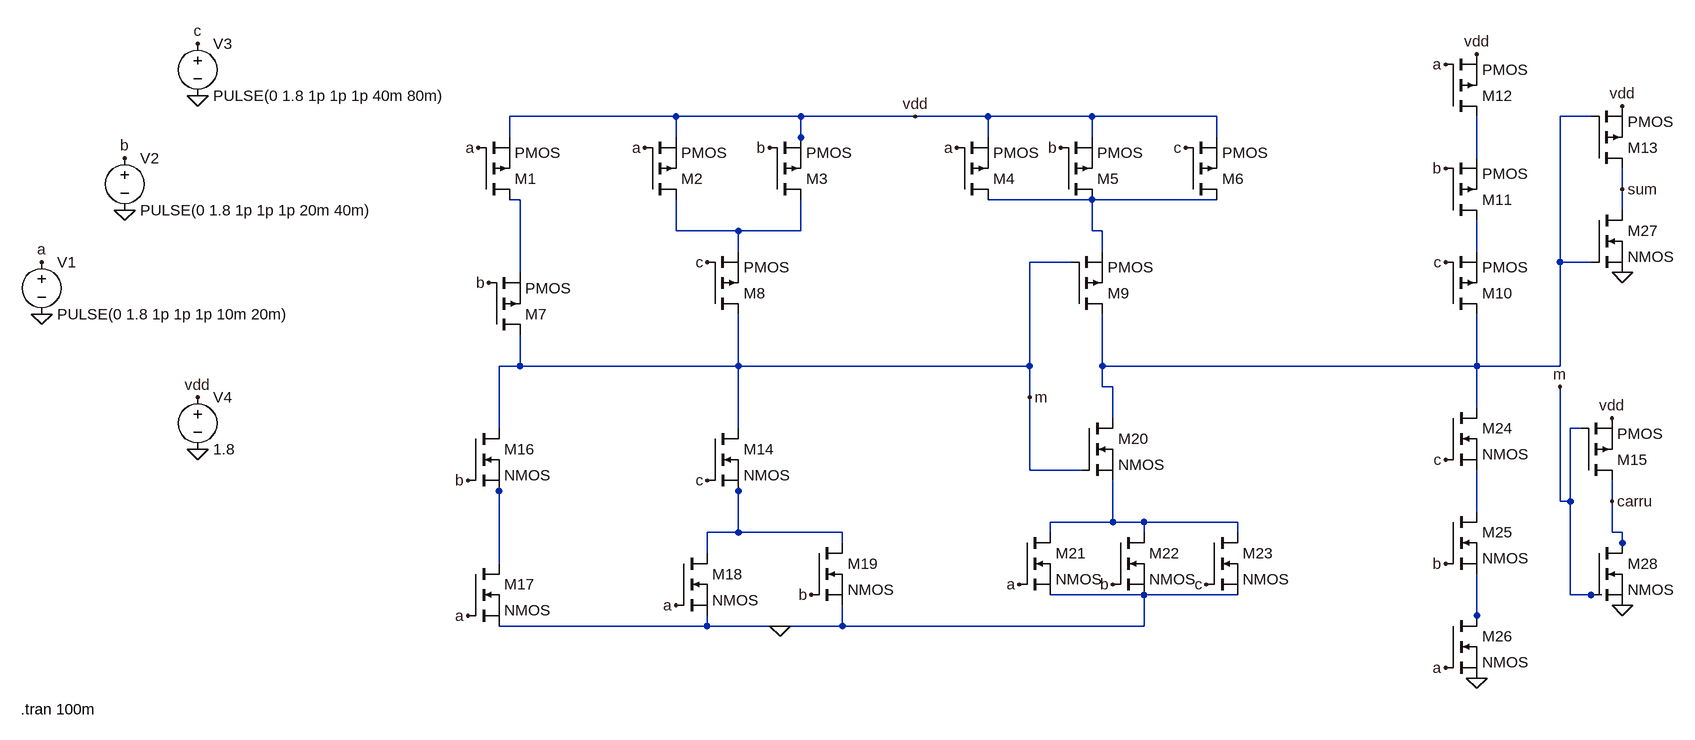
[diagram p0: schematic Full adder vani.asc]
Full adder vani.asc, the LTspice schematic file:
Version 4
SHEET 1 1808 896
WIRE 272 -32 16 -32
WIRE 464 -32 272 -32
WIRE 640 -32 464 -32
WIRE 752 -32 640 -32
WIRE 912 -32 752 -32
WIRE 1104 -32 912 -32
WIRE 1680 -32 1632 -32
WIRE 16 0 16 -32
WIRE 272 0 272 -32
WIRE 464 0 464 -32
WIRE 752 0 752 -32
WIRE 912 0 912 -32
WIRE 1104 0 1104 -32
WIRE 464 16 464 0
WIRE 1504 32 1504 -32
WIRE 1728 80 1728 48
WIRE 32 96 16 96
WIRE 912 96 752 96
WIRE 1104 96 912 96
WIRE 1728 112 1728 80
WIRE 272 144 272 96
WIRE 368 144 272 144
WIRE 464 144 464 96
WIRE 464 144 368 144
WIRE 912 144 912 96
WIRE 928 144 912 144
WIRE 368 176 368 144
WIRE 928 176 928 144
WIRE 1504 176 1504 128
WIRE 880 192 816 192
WIRE 1632 192 1632 -32
WIRE 1680 192 1632 192
WIRE 32 208 32 96
WIRE 32 352 32 304
WIRE 32 352 0 352
WIRE 368 352 368 272
WIRE 368 352 32 352
WIRE 816 352 816 192
WIRE 816 352 368 352
WIRE 928 352 928 272
WIRE 1504 352 1504 272
WIRE 1504 352 928 352
WIRE 1632 352 1632 192
WIRE 1632 352 1504 352
WIRE 928 384 928 352
WIRE 944 384 928 384
WIRE 816 400 816 352
WIRE 1504 416 1504 352
WIRE 944 432 944 384
WIRE 0 448 0 352
WIRE 368 448 368 352
WIRE 1664 448 1648 448
WIRE 816 512 816 400
WIRE 896 512 816 512
WIRE 0 544 0 528
WIRE 368 544 368 528
WIRE 1632 560 1632 384
WIRE 1648 560 1648 448
WIRE 1648 560 1632 560
WIRE 1712 560 1712 528
WIRE 1504 576 1504 512
WIRE 944 592 944 528
WIRE 944 592 848 592
WIRE 992 592 944 592
WIRE 1136 592 992 592
WIRE 368 608 368 544
WIRE 368 608 320 608
WIRE 528 608 368 608
WIRE 848 608 848 592
WIRE 992 608 992 592
WIRE 1136 608 1136 592
WIRE 1712 608 1712 560
WIRE 1728 608 1712 608
WIRE 528 624 528 608
WIRE 1728 624 1728 608
WIRE 320 640 320 608
WIRE 1728 640 1728 624
WIRE 0 656 0 544
WIRE 992 704 848 704
WIRE 1136 704 992 704
WIRE 1648 704 1648 560
WIRE 1680 704 1648 704
WIRE 1696 704 1680 704
WIRE 1504 736 1504 672
WIRE 320 752 320 736
WIRE 320 752 0 752
WIRE 432 752 320 752
WIRE 528 752 528 720
WIRE 528 752 432 752
WIRE 992 752 992 704
WIRE 992 752 528 752
WIRE 1504 752 1504 736
FLAG 1504 832 0
FLAG 1728 208 0
FLAG 1728 720 0
FLAG 432 752 0
FLAG -704 272 0
FLAG -576 112 0
FLAG -464 -64 0
FLAG -464 480 0
FLAG -704 192 a
FLAG -576 32 b
FLAG -464 -144 c
FLAG -464 400 vdd
FLAG 640 -32 vdd
FLAG 1504 -128 vdd
FLAG 1728 -48 vdd
FLAG 1712 432 vdd
FLAG -32 16 a
FLAG 224 16 a
FLAG 704 16 a
FLAG 1456 -112 a
FLAG 1456 816 a
FLAG 800 688 a
FLAG 272 720 a
FLAG -48 736 a
FLAG -16 224 b
FLAG -48 528 b
FLAG 416 16 b
FLAG 480 704 b
FLAG 944 688 b
FLAG 864 16 b
FLAG 320 192 c
FLAG 320 528 c
FLAG 1088 688 c
FLAG 1056 16 c
FLAG 1456 496 c
FLAG 1456 192 c
FLAG 1456 48 b
FLAG 1456 656 b
FLAG 1728 80 sum
FLAG 1712 560 carru
FLAG 816 400 m
FLAG 1632 384 m
SYMBOL pmos -32 96 M180
SYMATTR InstName M1
SYMBOL pmos 224 96 M180
SYMATTR InstName M2
SYMBOL pmos 416 96 M180
SYMATTR InstName M3
SYMBOL pmos 704 96 M180
SYMATTR InstName M4
SYMBOL pmos 864 96 M180
SYMATTR InstName M5
SYMBOL pmos 1056 96 M180
SYMATTR InstName M6
SYMBOL pmos -16 304 M180
SYMATTR InstName M7
SYMBOL pmos 320 272 M180
SYMATTR InstName M8
SYMBOL pmos 880 272 M180
SYMATTR InstName M9
SYMBOL pmos 1456 272 M180
SYMATTR InstName M10
SYMBOL pmos 1456 128 M180
SYMATTR InstName M11
SYMBOL pmos 1456 -32 M180
SYMATTR InstName M12
SYMBOL pmos 1680 48 M180
SYMATTR InstName M13
SYMBOL pmos 1664 528 M180
SYMATTR InstName M15
SYMBOL nmos 320 448 R0
SYMATTR InstName M14
SYMBOL nmos -48 448 R0
SYMATTR InstName M16
SYMBOL nmos -48 656 R0
SYMATTR InstName M17
SYMBOL nmos 272 640 R0
SYMATTR InstName M18
SYMBOL nmos 480 624 R0
SYMATTR InstName M19
SYMBOL nmos 896 432 R0
SYMATTR InstName M20
SYMBOL nmos 800 608 R0
SYMATTR InstName M21
SYMBOL nmos 944 608 R0
SYMATTR InstName M22
SYMBOL nmos 1088 608 R0
SYMATTR InstName M23
SYMBOL nmos 1456 416 R0
SYMATTR InstName M24
SYMBOL nmos 1456 576 R0
SYMATTR InstName M25
SYMBOL nmos 1456 736 R0
SYMATTR InstName M26
SYMBOL nmos 1680 112 R0
SYMATTR InstName M27
SYMBOL nmos 1680 624 R0
SYMATTR InstName M28
SYMBOL voltage -704 176 R0
WINDOW 123 0 0 Left 0
WINDOW 39 0 0 Left 0
SYMATTR InstName V1
SYMATTR Value PULSE(0 1.8 1p 1p 1p 10m 20m)
SYMBOL voltage -576 16 R0
WINDOW 123 0 0 Left 0
WINDOW 39 0 0 Left 0
SYMATTR InstName V2
SYMATTR Value PULSE(0 1.8 1p 1p 1p 20m 40m)
SYMBOL voltage -464 -160 R0
WINDOW 123 0 0 Left 0
WINDOW 39 0 0 Left 0
SYMATTR InstName V3
SYMATTR Value PULSE(0 1.8 1p 1p 1p 40m 80m)
SYMBOL voltage -464 384 R0
WINDOW 123 0 0 Left 0
WINDOW 39 0 0 Left 0
SYMATTR InstName V4
SYMATTR Value 1.8
TEXT -736 880 Left 2 !.tran 100m

The netlist it stands for:
* Full adder vani.asc
M1 N003 a vdd vdd PMOS
M2 N005 a vdd vdd PMOS
M3 N005 b vdd vdd PMOS
M4 N004 a vdd vdd PMOS
M5 N004 b vdd vdd PMOS
M6 N004 c vdd vdd PMOS
M7 m b N003 N003 PMOS
M8 m c N005 N005 PMOS
M9 N001 m N004 N004 PMOS
M10 N001 c N006 N006 PMOS
M11 N006 b N002 N002 PMOS
M12 N002 a vdd vdd PMOS
M13 sum N001 vdd vdd PMOS
M15 carru m vdd vdd PMOS
M14 m c N008 N008 NMOS
M16 m b N007 N007 NMOS
M17 N007 a 0 0 NMOS
M18 N008 a 0 0 NMOS
M19 N008 b 0 0 NMOS
M20 N001 m N010 N010 NMOS
M21 N010 a 0 0 NMOS
M22 N010 b 0 0 NMOS
M23 N010 c 0 0 NMOS
M24 N001 c N009 N009 NMOS
M25 N009 b N011 N011 NMOS
M26 N011 a 0 0 NMOS
M27 sum N001 0 0 NMOS
M28 carru m 0 0 NMOS
V1 a 0 PULSE(0 1.8 1p 1p 1p 10m 20m)
V2 b 0 PULSE(0 1.8 1p 1p 1p 20m 40m)
V3 c 0 PULSE(0 1.8 1p 1p 1p 40m 80m)
V4 vdd 0 1.8
.model NMOS NMOS
.model PMOS PMOS
.lib standard.mos
.tran 100m
.backanno
.end